# EAGLE design m1-mar (EAGLE 9.5.2)
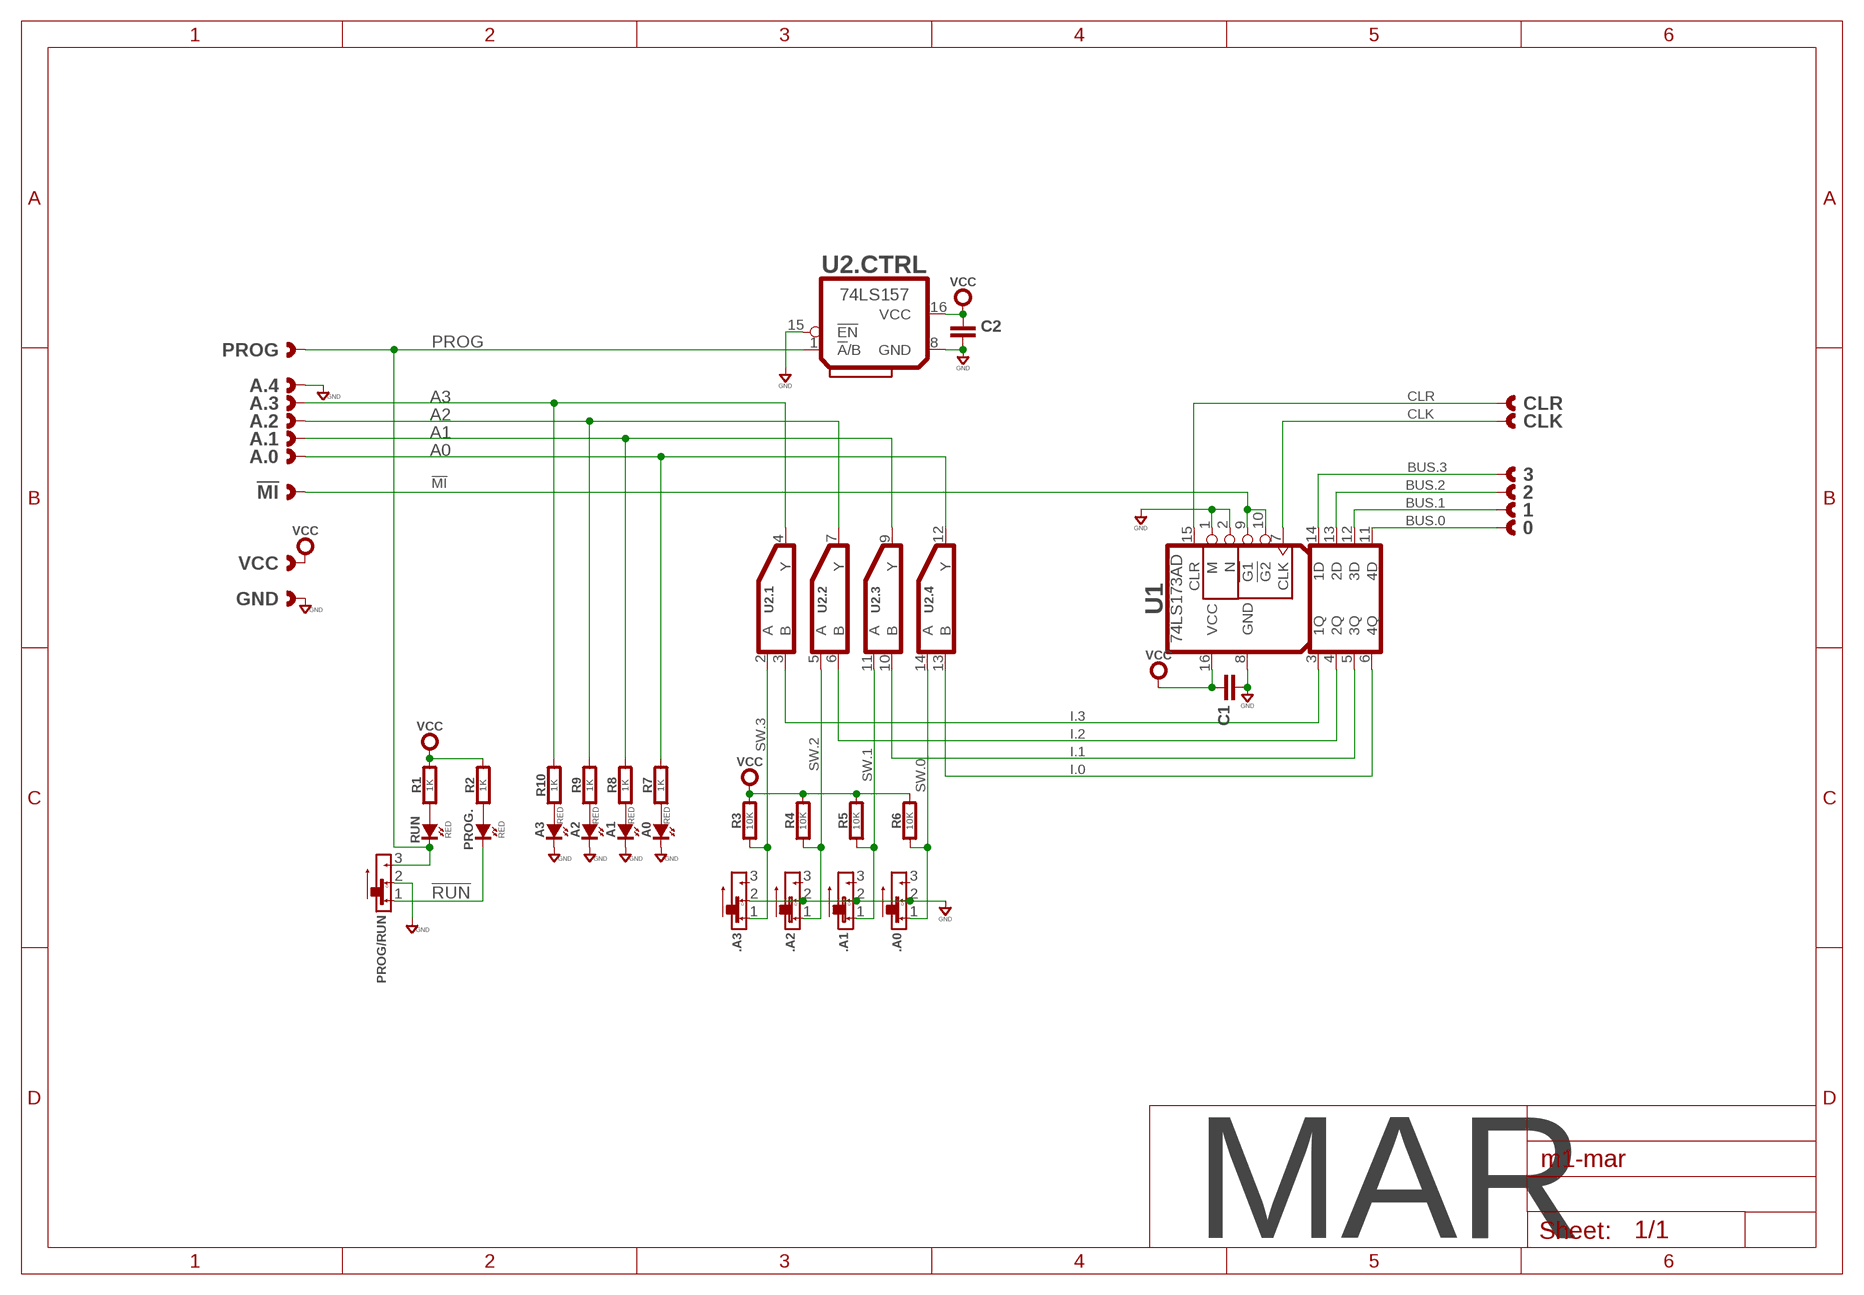
[diagram p0: schematic, sheet 1]

## Parts
0  CAST-01X1  [CAST01-2.54MM]
1  CAST-01X1  [CAST01-2.54MM]
2  CAST-01X1  [CAST01-2.54MM]
3  CAST-01X1  [CAST01-2.54MM]
!MI  CAST-01X1  [CAST01-2.54MM]
.A0  SLIDE-SPDTJS102011JCQN  [CK_JS102011JCQN]
.A1  SLIDE-SPDTJS102011JCQN  [CK_JS102011JCQN]
.A2  SLIDE-SPDTJS102011JCQN  [CK_JS102011JCQN]
.A3  SLIDE-SPDTJS102011JCQN  [CK_JS102011JCQN]
A0  RED  SMT0603  [SMD_0603]
A1  RED  SMT0603  [SMD_0603]
A2  RED  SMT0603  [SMD_0603]
A3  RED  SMT0603  [SMD_0603]
A.0  CAST-01X1  [CAST01-2.54MM]
A.1  CAST-01X1  [CAST01-2.54MM]
A.2  CAST-01X1  [CAST01-2.54MM]
A.3  CAST-01X1  [CAST01-2.54MM]
A.4  CAST-01X1  [CAST01-2.54MM]
C1  CAPACITOR0603  [0603-CAP]
C2  CAPACITOR0603  [0603-CAP]
CLK  CAST-01X1  [CAST01-2.54MM]
CLR  CAST-01X1  [CAST01-2.54MM]
GND  CAST-01X1  [CAST01-2.54MM]
PROG  CAST-01X1  [CAST01-2.54MM]
PROG.  RED  SMT0603  [SMD_0603]
PROG/RUN  SLIDE-SPDTJS102011JCQN  [CK_JS102011JCQN]
R1  1K  RESISTOR0603  [0603-RES]
R2  1K  RESISTOR0603  [0603-RES]
R3  10K  RESISTOR0603  [0603-RES]
R4  10K  RESISTOR0603  [0603-RES]
R5  10K  RESISTOR0603  [0603-RES]
R6  10K  RESISTOR0603  [0603-RES]
R7  1K  RESISTOR0603  [0603-RES]
R8  1K  RESISTOR0603  [0603-RES]
R9  1K  RESISTOR0603  [0603-RES]
R10  1K  RESISTOR0603  [0603-RES]
RUN  RED  SMT0603  [SMD_0603]
U1  74LS173AD  [SO16]
U2  74LS157  74LS157D  [SO16]
VCC  CAST-01X1  [CAST01-2.54MM]

## Nets
!MI: !MI.1 U1.9(!G1) U1.10(!G2)
!RUN: PROG..K(C) PROG/RUN.1
A0: A.0.1 R7.2 U2.12(.4:Y)
A1: A.1.1 R8.2 U2.9(.3:Y)
A2: A.2.1 R9.2 U2.7(.2:Y)
A3: A.3.1 R10.2 U2.4(.1:Y)
BUS.0: 0.1 U1.11(4D)
BUS.1: 1.1 U1.12(3D)
BUS.2: 2.1 U1.13(2D)
BUS.3: 3.1 U1.14(1D)
CLK: CLK.1 U1.7(CLK)
CLR: CLR.1 U1.15(CLR)
GND: .A0.2 .A1.2 .A2.2 .A3.2 A0.K(C) A1.K(C) A2.K(C) A3.K(C) A.4.1 C1.2 C2.2 GND.1 PROG/RUN.2 U1.1(M) U1.2(N) U1.8(GND) U2.8(.CTRL:GND) U2.15(.CTRL:!EN)
I.0: U1.6(4Q) U2.13(.4:B)
I.1: U1.5(3Q) U2.10(.3:B)
I.2: U1.4(2Q) U2.6(.2:B)
I.3: U1.3(1Q) U2.3(.1:B)
N$8: A0.A R7.1
N$17: R1.1 RUN.A
N$18: PROG..A R2.1
N$23: A1.A R8.1
N$24: A2.A R9.1
N$25: A3.A R10.1
PROG: PROG.1 PROG/RUN.3 RUN.K(C) U2.1(.CTRL:!A!/B)
SW.0: .A0.1 R6.1 U2.14(.4:A)
SW.1: .A1.1 R5.1 U2.11(.3:A)
SW.2: .A2.1 R4.1 U2.5(.2:A)
SW.3: .A3.1 R3.1 U2.2(.1:A)
VCC: C1.1 C2.1 R1.2 R2.2 R3.2 R4.2 R5.2 R6.2 U1.16(VCC) U2.16(.CTRL:VCC) VCC.1
Unconnected: .A0.3 .A1.3 .A2.3 .A3.3

## Notes on the sheet
- MAR

## Library data of the parts
0 1-3 !MI A.0 A.1-A.4 CLK CLR GND PROG VCC = con-headers:CAST-01X1: Castelated Edge Hole Pad
.A0 .A1-.A3 PROG/RUN = switch-smd:SLIDE-SPDT: Slide Switch - SPDT
A0 A1-A3 PROG. RUN = led:SMT: LED SMT
C1 C2 = rlc:CAPACITOR: Capacitor CAP
R1-R10 = rlc:RESISTOR: Resistor
U1 = logic:74*173A?: 74*173 Logic
U2 = logic:74*157?: 74*157 Multiplexor/Line-Selector 4-ch; MPN: 74LS157D

## Board
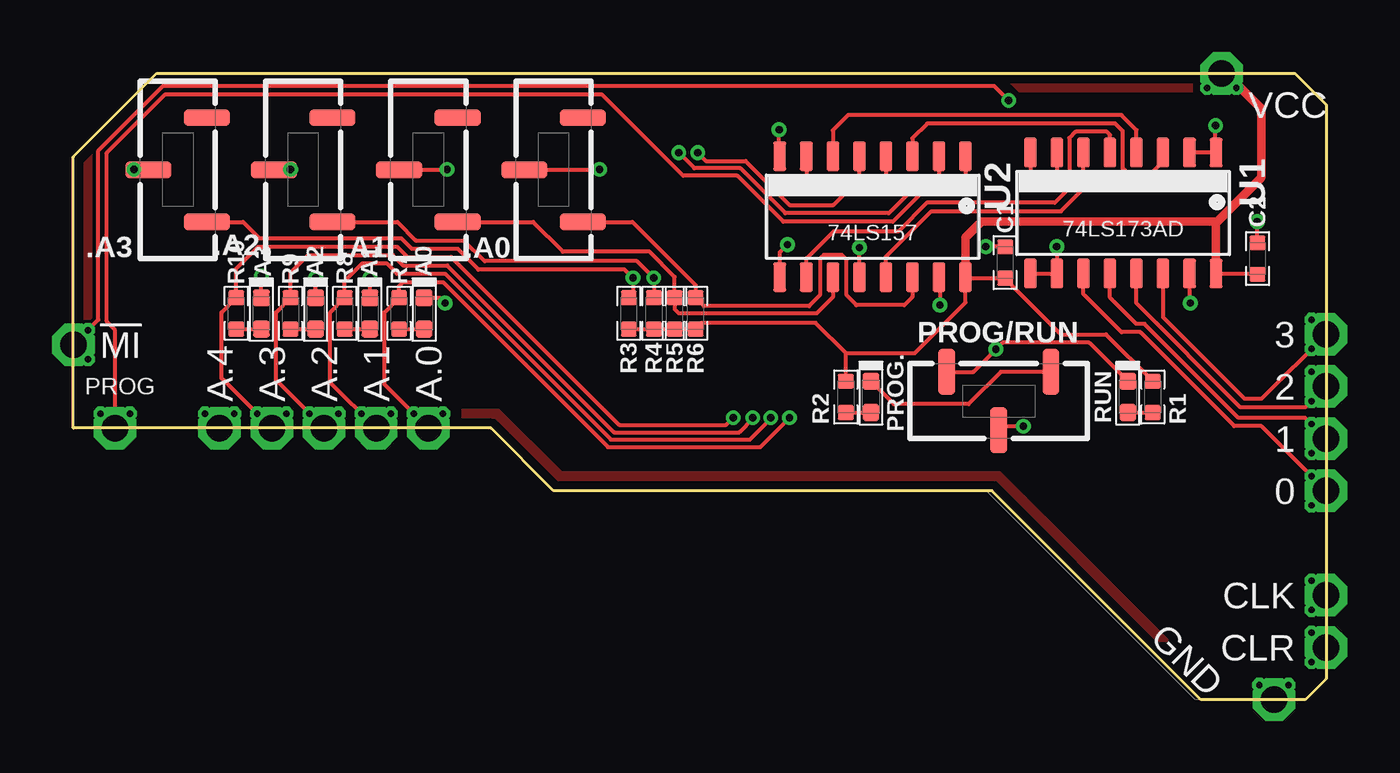
[diagram p1: board, top side]
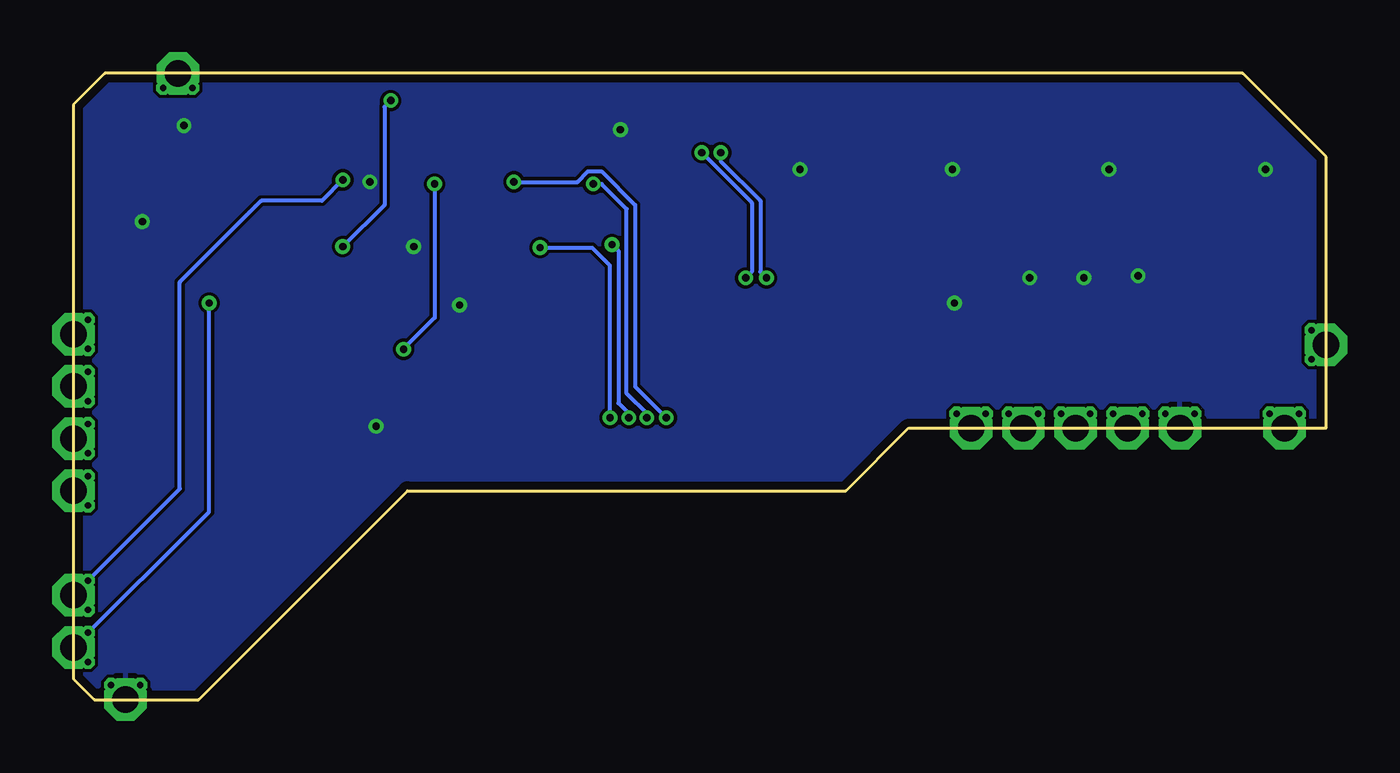
[diagram p2: board, bottom side, seen from below]

Size 60 x 30 mm. Coordinates in mm from the lower left corner, seen from the top.
Outline: 0,13 0,26 4,30 58.5,30 60,28.5 60,1 59,0 54,0 44,10 23,10 20,13 0,13
Copper layers (1*16): Top 0.0356mm / dielectric 1.5011mm / Bottom 0.0356mm
Design rules "OSH-CircuitMonkey *": minimum track width 6mil, minimum drill 13mil, track to track 6mil, track to pad 6mil, pad to pad 6mil, via to via 6mil, smd to smd 6mil, copper to edge 15mil, drill to drill 6mil, minimum pad ring 7mil, minimum via ring 7mil, stop-mask expansion 3mil, vias tented up to drill 14mil, thermal gap 10mil

### Footprints (pad centres in the part's own frame; a part is rotated, then mirrored left to right if it is on the bottom)
CAST01-2.54MM = drill 1.27 pad 2.032 octagon: 1 0,0 | drill 0.305 octagon: P$1 -0.7,0.7; P$2 -0.7,-0.7
CK_JS102011JCQN = smd 0.8 x 2.2: 1 -2.5,-1.4; 2 0,1.4; 3 2.5,-1.4
SMD_0603 = smd 0.8 x 0.8: A 0.75,0; K -0.75,0
0603-CAP = smd 0.711 x 0.762: 1 -0.752,0; 2 0.752,0
0603-RES = smd 0.711 x 0.762: 1 -0.752,0; 2 0.752,0
SO16 = smd 0.6 x 1.4: 1 -4.445,-2.9; 2 -3.175,-2.9; 3 -1.905,-2.9; 4 -0.635,-2.9; 5 0.635,-2.9; 6 1.905,-2.9; 7 3.175,-2.9; 8 4.445,-2.9; 9 4.445,2.9; 10 3.175,2.9; 11 1.905,2.9; 12 0.635,2.9; 13 -0.635,2.9; 14 -1.905,2.9; 15 -3.175,2.9; 16 -4.445,2.9

### Placement (x,y rotation side)
0  60,10 0 top
1  60,12.5 0 top
2  60,15 0 top
3  60,17.5 0 top
!MI  0,17 180 top
.A0  23,25.38 90 top
.A1  17,25.38 90 top
.A2  11,25.38 90 top
.A3  5,25.38 90 top
A0  16.8,18.5 270 top
A1  14.2,18.5 270 top
A2  11.6,18.5 270 top
A3  9,18.5 270 top
A.0  17,13 270 top
A.1  14.5,13 270 top
A.2  12,13 270 top
A.3  9.5,13 270 top
A.4  7,13 270 top
C1  44.63,20.94 90 top
C2  56.72,21.13 90 top
CLK  60,5 0 top
CLR  60,2.5 0 top
GND  57.5,0 270 top
PROG  2,13 270 top
PROG.  38.2,14.5 270 top
PROG/RUN  44.32,14.3 180 top
R1  51.7,14.5 90 top
R2  37,14.5 90 top
R3  26.6,18.5 270 top
R4  27.8,18.5 270 top
R5  28.8,18.5 270 top
R6  29.8,18.5 270 top
R7  15.6,18.5 90 top
R8  13,18.5 90 top
R9  10.4,18.5 90 top
R10  7.8,18.5 90 top
RUN  50.5,14.5 270 top
U1  50.28,23.31 180 top
U2  38.28,23.13 180 top
VCC  55,30 90 top

### Tracks (layer width: path | path; a pad name or v marks a point on that pad's centre or on a via)
!MI  (via drill 0.35)
  Top 0.2: !MI.1 1.2,18.2 1.2,26.3 4.3,29.4 44.1,29.4 v44.8,28.7 | v47.1,21.7 U1.10 | U1.10 | U1.9 47.09,20.41 U1.10
  Bottom 0.2: v44.8,28.7 45.1,28.4 45.1,23.7 v47.1,21.7
!RUN
  Top 0.2: PROG/RUN.1 44.42,15.7 42.87,14.15 39.3,14.15 PROG..K
A0  (via drill 0.35)
  Top 0.2: A.0.1 14.9,15.1 14.9,18.55 R7.2 15.6,19.8 15.8,20 17.7,20 25.6,12.1 32.9,12.1 v34.3,13.5 | U2.12 37.65,21.55 37.6,21.6 v37.65,21.65
  Bottom 0.2: v34.3,13.5 34.3,20.8 35.15,21.65 v37.65,21.65
A1  (via drill 0.35)
  Top 0.2: A.1.1 12.3,15.2 12.3,18.55 R8.2 13,20.05 13.85,20.9 15,20.9 15.5,20.4 17.8,20.4 25.75,12.45 32.4,12.45 33.42,13.47 v33.4,13.5 | U2.9 33.84,21.43 v34.2,21.8
  Bottom 0.2: v33.4,13.5 33.4,13.7 33.9,14.21 33.9,21.5 v34.2,21.8
A2  (via drill 0.35)
  Top 0.2: A.2.1 9.7,15.3 9.7,18.55 R9.2 10.4,20.45 11.25,21.3 15.3,21.3 15.8,20.8 17.9,20.8 25.89,12.8 31.9,12.8 32.54,13.44 v32.54,13.5 | U2.7 v35.1,24.7
  Bottom 0.2: v35.1,24.7 34.7,24.7 33.5,23.5 33.5,14.66 32.54,13.7 v32.54,13.5
A3  (via drill 0.35)
  Top 0.2: A.3.1 7.1,15.4 7.1,18.55 R10.2 7.8,20.65 8.85,21.7 15.5,21.7 16,21.2 18.1,21.2 26.14,13.16 31.26,13.16 v31.6,13.5 | U2.4 38.91,24.91 38.9,24.9 v38.9,24.8
  Bottom 0.2: v38.9,24.8 35.86,24.8 35.35,25.3 34.7,25.3 33.1,23.7 33.1,15 v31.6,13.5
AAA
  pour Top: 23.2,10.5 44.2,10.5 51.9,2.8 52.4,2.8 52.45,2.85 44.4,10.9 23.4,10.9 20.4,13.9 18.6,13.9 18.6,13.5 20.2,13.5
BBB
  pour Top: 0.5,18.2 0.9,18.2 0.9,26.1 0.5,25.7
BUS.0
  Top 0.2: 0.1 56.9,13.1 55.6,13.1 51.1,17.6 50.2,17.6 48.38,19.43 U1.11
BUS.1
  Top 0.2: 1.1 59,13.5 55.8,13.5 51.3,18 50.9,18 49.65,19.25 U1.12
BUS.2
  Top 0.2: 2.1 59,14 55.9,14 50.91,18.98 U1.13
BUS.3
  Top 0.2: 3.1 56.9,14.4 56.1,14.4 52.19,18.32 U1.14
CCC
  pour Top: 44.9,29.5 53.6,29.5 53.6,29.1 45.3,29.1
CLK  (via drill 0.35)
  Top 0.2: U1.7 47.1,24.91 v47.1,24.9 v47.09,24.9
  Bottom 0.2: CLK.1 54.9,10.1 54.9,20 51,23.9 48.09,23.9 v47.09,24.9
CLR  (via drill 0.35)
  Top 0.2: U1.15 53.45,19.05 v53.5,19
  Bottom 0.2: v53.5,19 53.5,9 CLR.1
GND  (via drill 0.35)
  Top 0.2: A3.K v9,20.3 | A2.K v11.6,20.2 | A1.K v14.2,20.2 | A0.K 17.55,19.25 v17.8,19 | .A3.2 2.92,25.38 v2.9,25.4 | .A2.2 10.42,25.38 v10.4,25.4 | .A1.2 17.92,25.38 v17.9,25.4 | .A0.2 25.22,25.38 v25.2,25.4 | U2.15 41.5,20.18 v41.5,18.9 | U2.8 33.8,26.07 v33.8,27.3 | U1.8 45.84,24.84 v45.8,24.8 | U1.1 54.7,26.23 | 54.7,26.23 v54.7,27.5 | U1.2 53.48,26.23 54.7,26.23 | C1.2 v43.7,21.7 | C2.2 56.7,21.89 v56.7,22.9 | PROG/RUN.2 44.35,12.93 44.35,13.1 v45.5,13.1
  pour Bottom: 0,13 0,26 4,30 58.5,30 60,28.5 60,1 59,0 54,0 44,10 23,10 20,13
I.0
  Top 0.2: U1.6 48.36,26.19 48.36,24.46 47.3,23.4 41.1,23.4 38.91,21.21 U2.13
I.1
  Top 0.2: U1.5 49.65,27.05 49.5,27.2 48,27.2 47.7,26.9 47.7,24.5 47,23.8 40.88,23.8 39.51,22.43 36.41,22.43 35.1,21.13 U2.10
I.2
  Top 0.2: U1.4 50.91,27.29 50.2,28 37.1,28 36.38,27.27 U2.6
I.3
  Top 0.2: U1.3 52.19,25.78 51.67,25.26 50.46,25.26 50.26,25.46 50.26,27.24 49.9,27.6 40.9,27.6 40.19,26.89 U2.3
N$8
  Top 0.2: R7.1 A0.A
N$17
  Top 0.2: RUN.A R1.1
N$18
  Top 0.2: R2.1 PROG..A
N$23
  Top 0.2: R8.1 A1.A
N$24
  Top 0.2: R9.1 A2.A
N$25
  Top 0.2: R10.1 A3.A
PROG  (via drill 0.35)
  Top 0.2: PROG.1 2,17.7 1.6,18.1 1.6,26.2 4.4,29 25.3,29 29.2,25.1 31.8,25.1 34.01,22.89 39.25,22.89 40.66,24.3 42.3,24.3 v42.7,24.7 42.73,24.73 U2.1 | PROG/RUN.3 43.1,15.7 v44.18,16.78 44.5,17.1 48.65,17.1 RUN.K
  Bottom 0.2: v42.7,24.7 42.7,18.3 44.2,16.8 v44.18,16.78
SW.0
  Top 0.2: 40.07,19.81 40.19,19.93 U2.14 40.19,19.29 39.8,18.9 37.5,18.9 37.03,19.37 37.03,21.08 36.81,21.3 35.94,21.3 35.76,21.12 35.76,19.38 35.23,18.85 30.2,18.85 R6.1 29.8,19.85 26.77,22.88 .A0.1
SW.1
  Top 0.2: .A1.1 22.02,22.88 23.45,21.45 27.6,21.45 28.8,20.25 R5.1 28.8,18.7 29,18.5 35.6,18.5 36.38,19.27 U2.11
SW.2  (via drill 0.35)
  Top 0.2: .A2.1 15.52,22.88 16.4,22 18.7,22 19.7,21 27,21 v27.8,20.2 R4.1 | v29.9,26.2 30.3,25.8 32.2,25.8 34.3,23.7 36.4,23.7 37.65,24.95 U2.5
  Bottom 0.2: v27.8,20.2 27.5,20.5 27.5,23.8 v29.9,26.2
SW.3  (via drill 0.35)
  Top 0.2: .A3.1 8.12,22.88 8.9,22.1 15.7,22.1 16.2,21.6 18.4,21.6 19.4,20.6 26.4,20.6 v26.8,20.2 26.8,19.45 R3.1 | U2.2 41.45,25.05 41.05,24.65 40.41,24.65 39.06,23.3 34.1,23.3 31.95,25.45 29.75,25.45 v29,26.2
  Bottom 0.2: v26.8,20.2 27.1,20.5 27.1,23.9 29,25.8 v29,26.2
VCC
  Top 0.2: R2.2 37,16.6 | 37,16.6 40.3,16.6 42.73,19.02 U2.16 42.77,20.19 C1.1 47.3,17.5 49.45,17.5 R1.2 | R3.2 R4.2 R5.2 R6.2 30.1,18.05 35.55,18.05 37,16.6 | U1.16 56.68,20.41 C2.1
  Top 0.4: U2.16 42.73,22.12 43.5,22.9 54.8,22.9 | 54.8,22.9 56.9,25 56.9,28.3 55.2,30 VCC.1 | U1.16 54.73,22.82 54.8,22.9

### Text on the board
tDocu: Vcc | 3 | !MI | 2 | PROG | A4 | A3 | A2 | A1 | A0 | 1 | 0 | CLK | CLR | GND